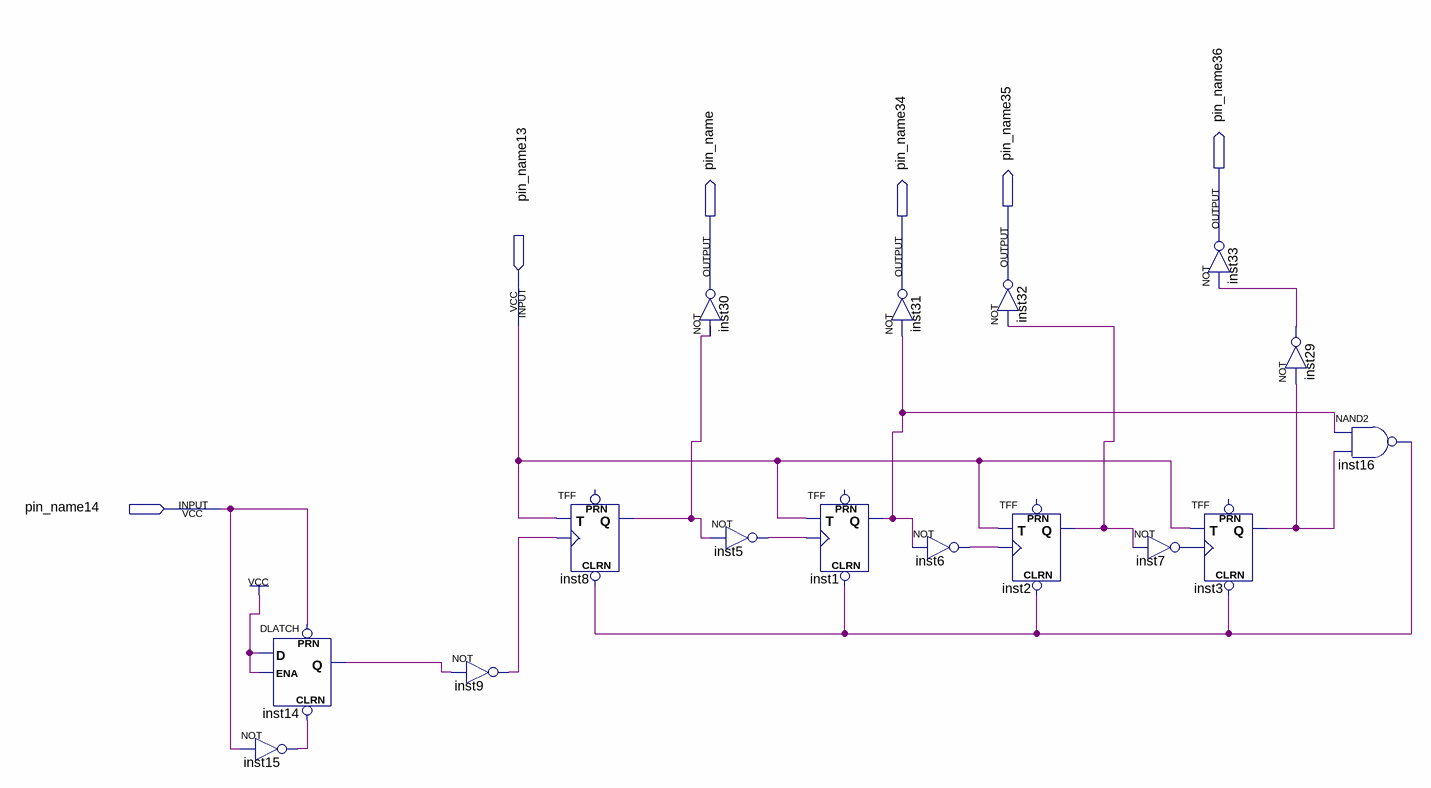
[diagram p0: schematic sheet]
// Quartus schematic dw.bdf as structural Verilog: 16 symbols, 6 pins
module dw (
  input  pin_name13,
  input  pin_name14,
  output pin_name36,
  output pin_name35,
  output pin_name,
  output pin_name34
);

  wire inst1_q, inst2_q, inst3_q, inst5_out, inst6_out, inst7_out, inst8_q, inst9_out, inst14_q, inst15_out,
       inst16_out, inst29_out;

  DLATCH inst14 (.CLRN(inst15_out), .D(1'b1), .ENA(1'b1), .PRN(pin_name14), .Q(inst14_q));
  not inst15 (inst15_out, pin_name14);
  not inst9 (inst9_out, inst14_q);
  TFF inst8 (.CLRN(inst16_out), .T(pin_name13), .CLK(inst9_out), .Q(inst8_q));  // open: PRN
  not inst30 (pin_name, inst8_q);
  not inst5 (inst5_out, inst8_q);
  TFF inst1 (.CLRN(inst16_out), .T(pin_name13), .CLK(inst5_out), .Q(inst1_q));  // open: PRN
  not inst31 (pin_name34, inst1_q);
  not inst6 (inst6_out, inst1_q);
  not inst32 (pin_name35, inst2_q);
  TFF inst2 (.CLRN(inst16_out), .T(pin_name13), .CLK(inst6_out), .Q(inst2_q));  // open: PRN
  not inst33 (pin_name36, inst29_out);
  TFF inst3 (.CLRN(inst16_out), .T(pin_name13), .CLK(inst7_out), .Q(inst3_q));  // open: PRN
  not inst7 (inst7_out, inst2_q);
  not inst29 (inst29_out, inst3_q);
  nand inst16 (inst16_out, inst1_q, inst3_q);
endmodule
